# EAGLE design over voltage protection v1 (EAGLE 5.07)
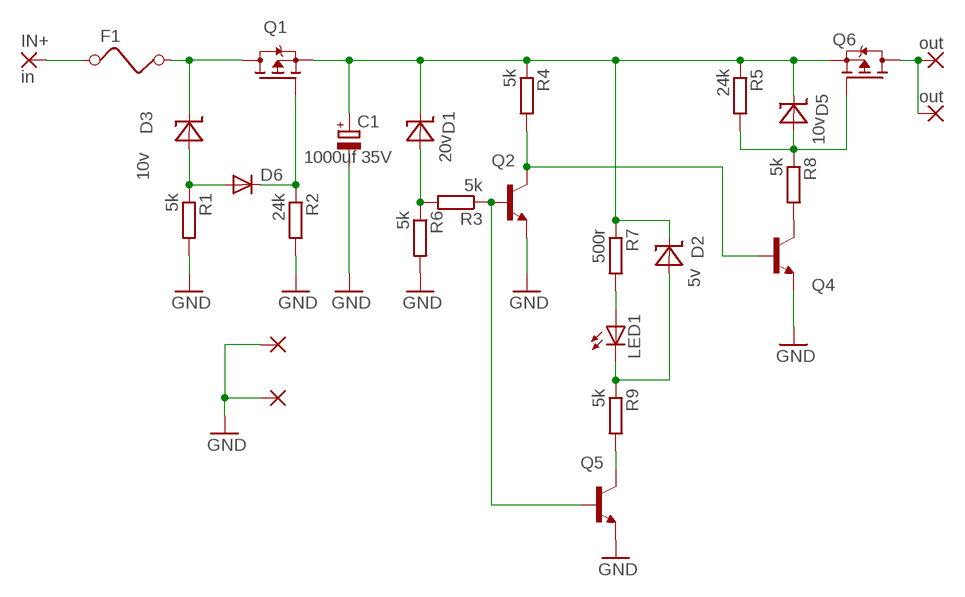
[diagram p0: schematic, sheet 1]

## Parts
C1  1000uf 35V  CPOL-EUD  [PANASONIC_D]
D1  20v  1206ZENERSOD323  [SOD323-W]
D2  5v  1206ZENERSOD323  [SOD323-W]
D3  10v  1206ZENERSOD323  [SOD323-W]
D5  10v  1206ZENERSOD323  [SOD323-W]
D6  DIODE-SOD323-W  [SOD323-W]
F1  FUSESMD  [LITTLEFUSE]
GND  gnd  2,54/1,0  [2,54/1,0]
GND8  gnd  2,54/1,0  [2,54/1,0]
IN+  in  2,54/1,0  [2,54/1,0]
LED1  LED5MM  [LED5MM]
OUT+  out  2,54/1,0  [2,54/1,0]
OUT+1  out  2,54/1,0  [2,54/1,0]
Q1  SPD30P06PTO252  [TO252]
Q2  BC849SMD  [SOT23-BEC]
Q4  BC849SMD  [SOT23-BEC]
Q5  BC849SMD  [SOT23-BEC]
Q6  SPD30P06PTO252  [TO252]
R1  5k  R-EU_M1206  [M1206]
R2  24k  R-EU_M1206  [M1206]
R3  5k  R-EU_M1206  [M1206]
R4  5k  R-EU_M1206  [M1206]
R5  24k  R-EU_M1206  [M1206]
R6  5k  R-EU_M1206  [M1206]
R7  500r  R-EU_M1206  [M1206]
R8  5k  R-EU_M1206  [M1206]
R9  5k  R-EU_M1206  [M1206]

## Nets
DARLINGTON: Q2.C Q4.B R4.2
GND [power]: C1.- GND8.1(P) GND.1(P) Q2.E Q4.E Q5.E R1.2 R2.2 R6.2
INPUT [power]: D3.C F1.P$2 Q1.3(D)
N$1 [power]: OUT+1.1(P) OUT+.1(P) Q6.3(D)
N$2: Q5.C R9.2
N$3: Q2.B Q5.B R3.1
N$4 [power]: F1.P$1 IN+.1(P)
N$5: D1.A R3.2 R6.1
N$6: Q4.C R8.2
N$7: D3.A D6.A R1.1
N$8 [medpower]: D2.A LED1.K(C) R9.1
N$9: D5.A Q6.1(G) R5.2 R8.1
N$10: D6.C Q1.1(G) R2.1
N$11: LED1.A R7.2
STATUS [power]: C1.+ D1.C D2.C D5.C Q1.2(S) Q6.2(S) R4.1 R5.1 R7.1

## Library data of the parts
C1 = matt rcl:CPOL-EU: POLARIZED CAPACITOR, European symbol
D1-D3 D5 = matt diode:1206ZENER
D6 = matt diode:DIODE-: DIODE
F1 = matt special:FUSE: FUSE 5 x 20 mm
GND GND8 IN+ OUT+ OUT+1 = wirepad:2,54/1,0: THROUGH-HOLE PAD
LED1 = matt led:LED: LED OSRAM: - CHIPLED LG R971, LG N971, LY N971, LG Q971, LY Q971, LO R971, LY R971 LH N974, LH R974 LS Q976, LO Q976, LY Q976 LO Q996 - Hyper CHIPLED LW Q18S LB Q993, LB Q99A, LB R99A - SideLED LS A670, LO A670, LY A670, LG A670, LP A670 LB A673, LV A673, LT A673, LW A673 LH A674 LY A675 LS A676, LA A676, LO A676, LY A676, LW A676 LS A679, LY A679, LG A679 - Hyper Micro SIDELED® LS Y876, LA Y876, LO Y876, LY Y876 LT Y87S - SmartLED LW L88C, LW L88S LB L89C, LB L89S, LG L890 LS L89K, LO L89K, LY L89K LS L896, LA L896, LO L896, LY L896 - TOPLED LS T670, LO T670, LY T670, LG T670, LP T670 LSG T670, LSP T670, LSY T670, LOP T670, LYG T670 LG T671, LOG T671, LSG T671 LB T673, LV T673, LT T673, LW T673 LH T674 LS T676, LA T676, LO T676, LY T676, LB T676, LH T676, LSB T676, LW T676 LB T67C, LV T67C, LT T67C, LS T67K, LO T67K, LY T67K, LW E67C LS E67B, LA E67B, LO E67B, LY E67B, LB E67C, LV E67C, LT E67C LW T67C LS T679, LY T679, LG T679 LS T770, LO T770, LY T770, LG T770, LP T770 LB T773, LV T773, LT T773, LW T773 LH T774 LS E675, LA E675, LY E675, LS T675 LS T776, LA T776, LO T776, LY T776, LB T776 LHGB T686 LT T68C, LB T68C - Hyper Mini TOPLED® LB M676 - Mini TOPLED Santana® LG M470 LS M47K, LO M47K, LY M47K Source: http://www.osram.convergy.de LUXEON: - LUMILED® LXK2-PW12-R00, LXK2-PW12-S00, LXK2-PW14-U00, LXK2-PW14-V00 LXK2-PM12-R00, LXK2-PM12-S00, LXK2-PM14-U00 LXK2-PE12-Q00, LXK2-PE12-R00, LXK2-PE12-S00, LXK2-PE14-T00, LXK2-PE14-U00 LXK2-PB12-K00, LXK2-PB12-L00, LXK2-PB12-M00, LXK2-PB14-N00, LXK2-PB14-P00, LXK2-PB14-Q00 LXK2-PR12-L00, LXK2-PR12-M00, LXK2-PR14-Q00, LXK2-PR14-R00 LXK2-PD12-Q00, LXK2-PD12-R00, LXK2-PD12-S00 LXK2-PH12-R00, LXK2-PH12-S00 LXK2-PL12-P00, LXK2-PL12-Q00, LXK2-PL12-R00 Source: www.luxeon.com KINGBRIGHT: KA-3528ASYC Source: www.kingbright.com
Q1 Q6 = matt transistor-fet:SPD30P06P: SIPMOS(R) Power-Transistor P-Channel, Enhancement mode Source: http://www.infineon.com/upload/Document/cmc_upload/documents/012/3615/SPD_U30P06P.pdf
Q2 Q4 Q5 = matt transistor-npn:BC849*: NPN Transistor
R1-R9 = resistor:R-EU_: RESISTOR, European symbol

## Net classes
0 default: width 0.5 mm
1 power: width 1.5 mm
2 medpower: width 1 mm

## Board
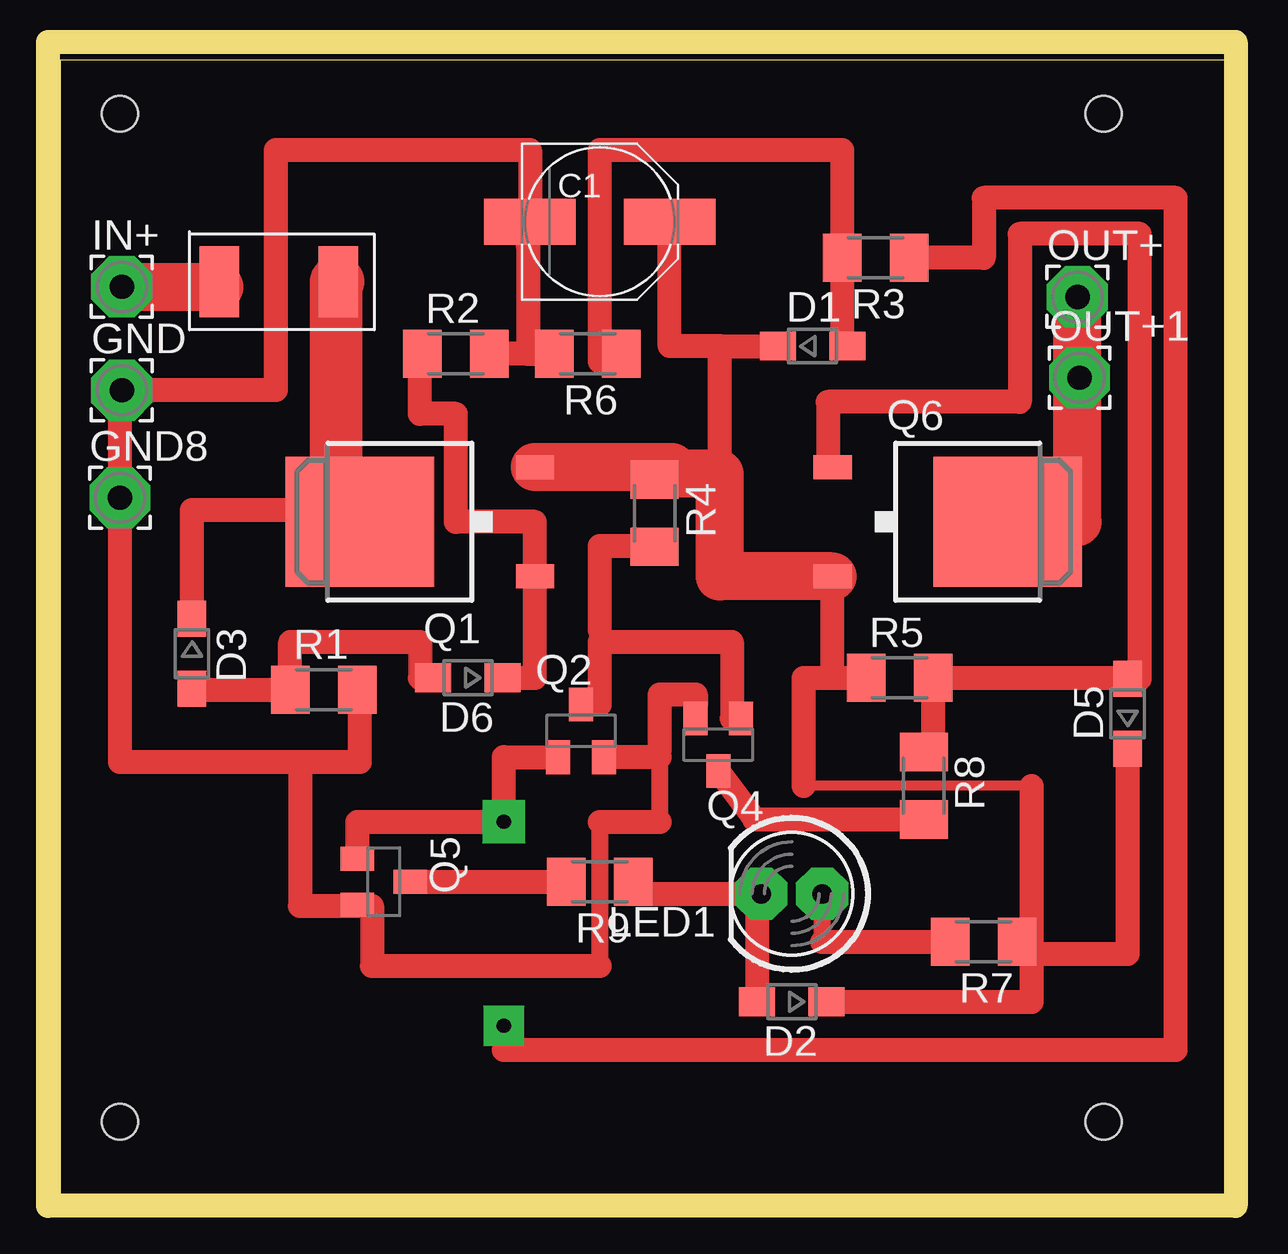
[diagram p1: board, top side]
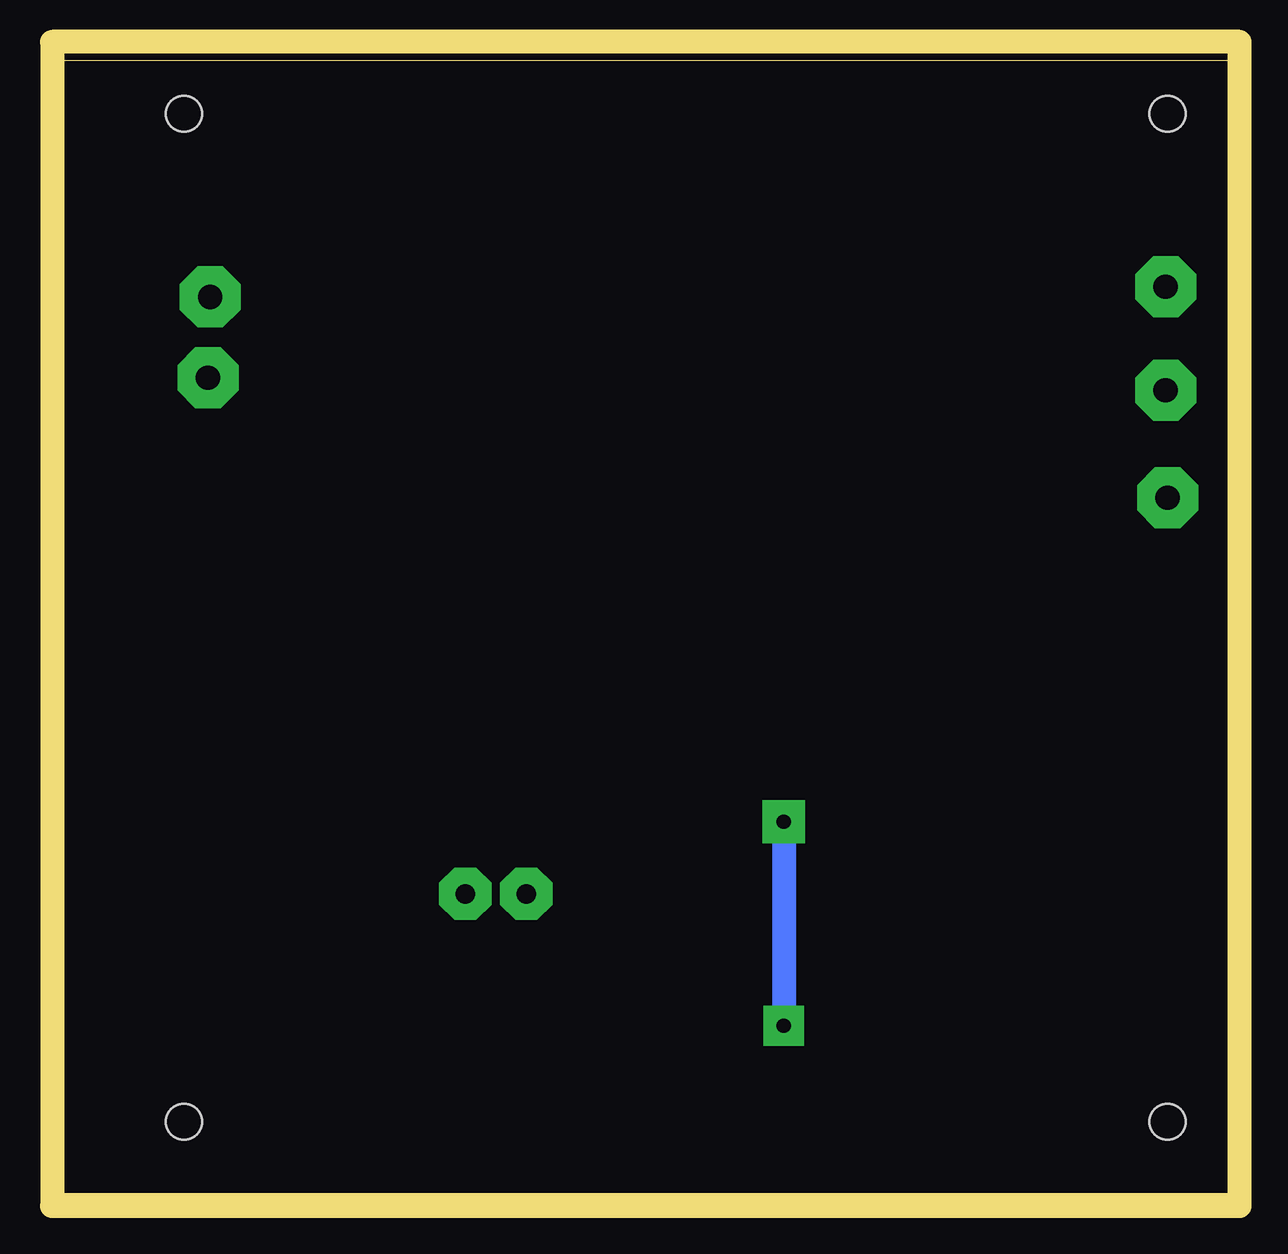
[diagram p2: board, bottom side, seen from below]

Size 48.67 x 47.24 mm. Coordinates in mm from the lower left corner, seen from the top.
Outline: 0,0 48.67,0 48.67,47.24 0,47.24 0,0
Copper layers (1*16): Top 0.035mm / dielectric 1.5mm / Bottom 0.035mm
Design rules "default": minimum track width 10mil, minimum drill 24mil, track to track 8mil, track to pad 8mil, pad to pad 8mil, via to via 8mil, smd to smd 8mil, copper to edge 40mil, drill to drill 8mil, minimum pad ring 10mil, minimum via ring 8mil, stop-mask expansion 4mil, vias tented up to drill 0mil, thermal gap 10mil
Holes 1.5 mm at 43.5,45 2.5,45 2.5,3 43.5,3
Milling: 4 lines

### Footprints (pad centres in the part's own frame; a part is rotated, then mirrored left to right if it is on the bottom)
PANASONIC_D = smd 3.81 x 1.93: + 2.908,0; - -2.908,0
SOD323-W = smd 1.5 x 1.2: A 1.45,0; C -1.45,0
LITTLEFUSE = smd 1.65 x 2.97: P$1 -2.35,0; P$2 2.6,0
2,54/1,0 = drill 1.016 pad 2.54 octagon: 1 0,0
LED5MM = drill 0.813 pad 2.184 octagon: A -1.27,0; K 1.27,0
TO252 = smd 1 x 1.6: 1 -2.28,-4.8; 2 2.28,-4.8 | smd 5.4 x 6.2: 3 0,2.5
SOT23-BEC = smd 1 x 1.4: B -0.95,-1.1; C 0,1.1; E 0.95,-1.1
M1206 = smd 1.6 x 2: 1 -1.4,0; 2 1.4,0

### Placement (x,y rotation side)
C1  22.5,40.5 0 top
D1  31.37,35.32 0 top
D2  30.5,8 180 top
D3  5.5,22.5 270 top
D5  44.5,20 90 top
D6  17,21.5 180 top
F1  9,38 0 top
GND  2.58,33.48 0 top
GND8  2.5,29 0 top
IN+  2.58,37.79 0 top
LED1  30.5,12.5 180 top
OUT+  42.41,37.37 0 top
OUT+1  42.5,34 0 top
Q1  15,28 90 top
Q2  21.72,19.29 0 top
Q4  27.44,18.71 180 top
Q5  13.5,13 270 top
Q6  37,28 270 top
R1  11,21 0 top
R2  16.5,35 0 top
R3  34,39 180 top
R4  24.79,28.36 270 top
R5  35,21.5 0 top
R6  22,35 180 top
R7  38.5,10.5 180 top
R8  36,17 270 top
R9  22.5,13 180 top

### Tracks (layer width: path | path; a pad name or v marks a point on that pad's centre or on a via)
DARLINGTON
  Top 0.406: Q2.C 22.5,20.39 | 24.79,27 R4.2 | 28,19.81 Q4.B | 22.5,23 22.5,23.5
  Top 1: 22.5,20.39 22.5,23 28,23 28,19.81 | 22.5,23.5 22.5,27 24.79,27
GND
  Top 0.406: 25,18.5 25,18.19
  Top 0.5: 20.53,35 R6.2 20.5,34.68 | 12.5,21 R1.2 | 13,12 12.4,12 Q5.E
  Top 0.7: 25,15.5 25,18.5 | 22.5,9.5 22.5,15.5
  Top 1: 19.5,35 R2.2 | 19.5,35 20.53,35 | 12.5,21 12.5,18 10,18 | 12.4,12 10,12 10,18 | Q4.E 26.5,20.81 25,20.81 25,18.5 | 22.5,15.5 25,15.5 | 22.5,9.5 13,9.5 13,12 | 25,18.19 Q2.E | 10,18 2.5,18 GND8.1 2.5,33.48 GND.1 2.58,33.5 9,33.5 9,43.5 19.59,43.5 C1.- 19.5,39.5 19.5,35
INPUT
  Top 1: D3.C 5.5,28.5 11.5,28.5
  Top 2.184: F1.P$2 11.5,38 11.5,28.5 12.5,28.5 Q1.3
N$1
  Top 0.406: Q6.3 42.41,28
  Top 1: 42.41,34 OUT+1.1
  Top 2: 42.41,28 42.41,34 OUT+.1
N$2
  Top 1: Q5.C R9.2
N$3  (via drill 0.6 pad 1.68, 0.6 pad 1.78)
  Top 1: Q5.B 12.4,15.5 v18.5,15.5 18.5,18.19 Q2.B | R3.1 38.5,39 38.5,41.5 46.5,41.5 46.5,6 18.5,6 v18.5,7
  Bottom 1: v18.5,15.5 v18.5,7
N$4
  Top 1.5: 6.65,37.79 F1.P$1
  Top 2: IN+.1 6.65,37.79
N$5
  Top 0.5: 22.5,34.68 R6.1 | D1.A 32.6,35.32 32.42,35.32
  Top 1: 22.5,34.68 22.5,43.5 32.6,43.5 R3.2 32.6,35.32
N$6
  Top 1: R8.2 28.94,15.6 Q4.C
N$7
  Top 0.406: 15,21.5 D6.A
  Top 0.5: D3.A 5.5,21
  Top 1: 5.5,21 R1.1 9.6,23 15,23 15,21.5
N$8
  Top 0.5: 29.05,12.5 LED1.K
  Top 1: D2.A 29.05,12.5 23.9,12.5 R9.1
N$9
  Top 0.406: 32,30.28 Q6.1 | 36.5,21.5 R5.2 36,21.5 36,21 36.5,21 36.5,21.5 | 36.5,21.5 37,21.5 37,22 36.5,22 36.5,21.5 | 44,21.5 44,21.45
  Top 0.7: D5.A 44,21.45 43,21.45
  Top 1: 32,30.28 32,33 40,33 40,40 45,40 45,21.45 D5.A | R8.1 36.4,18.4 R5.2 | 37,21.5 44,21.5
N$10
  Top 1: D6.C 19.8,21.5 Q1.1 19.8,28 16.5,28 16.5,32.5 15,32.5 15,35 R2.1
N$11
  Top 0.7: LED1.A 31.77,10.5
  Top 1: 31.77,10.5 R7.2
STATUS
  Top 0.406: R7.1 39.9,10 | 25.5,30.28 25.5,30 24.79,30 R4.1 | R5.1 32.2,21.5 | 40.5,17 31,17
  Top 0.5: 40.5,11 39.9,11 R7.1
  Top 0.7: 40.5,10.5 40.5,11
  Top 1: D2.C 40.5,8 40.5,10.5 40.5,17 | D5.C 44.5,10 39.9,10 | 27.5,35.32 D1.C | 27.5,30 27.5,35.32 | 32.2,21.5 Q6.2 | R5.1 31,21.5 31,17 | 27.5,35.32 25.41,35.32 C1.+
  Top 2: 25.5,30.28 Q1.2 | 25.5,30 27.5,30 27.5,25.72 Q6.2